# EAGLE board regsimple2addfp copy (EAGLE 7.6.0), part 1 of 2
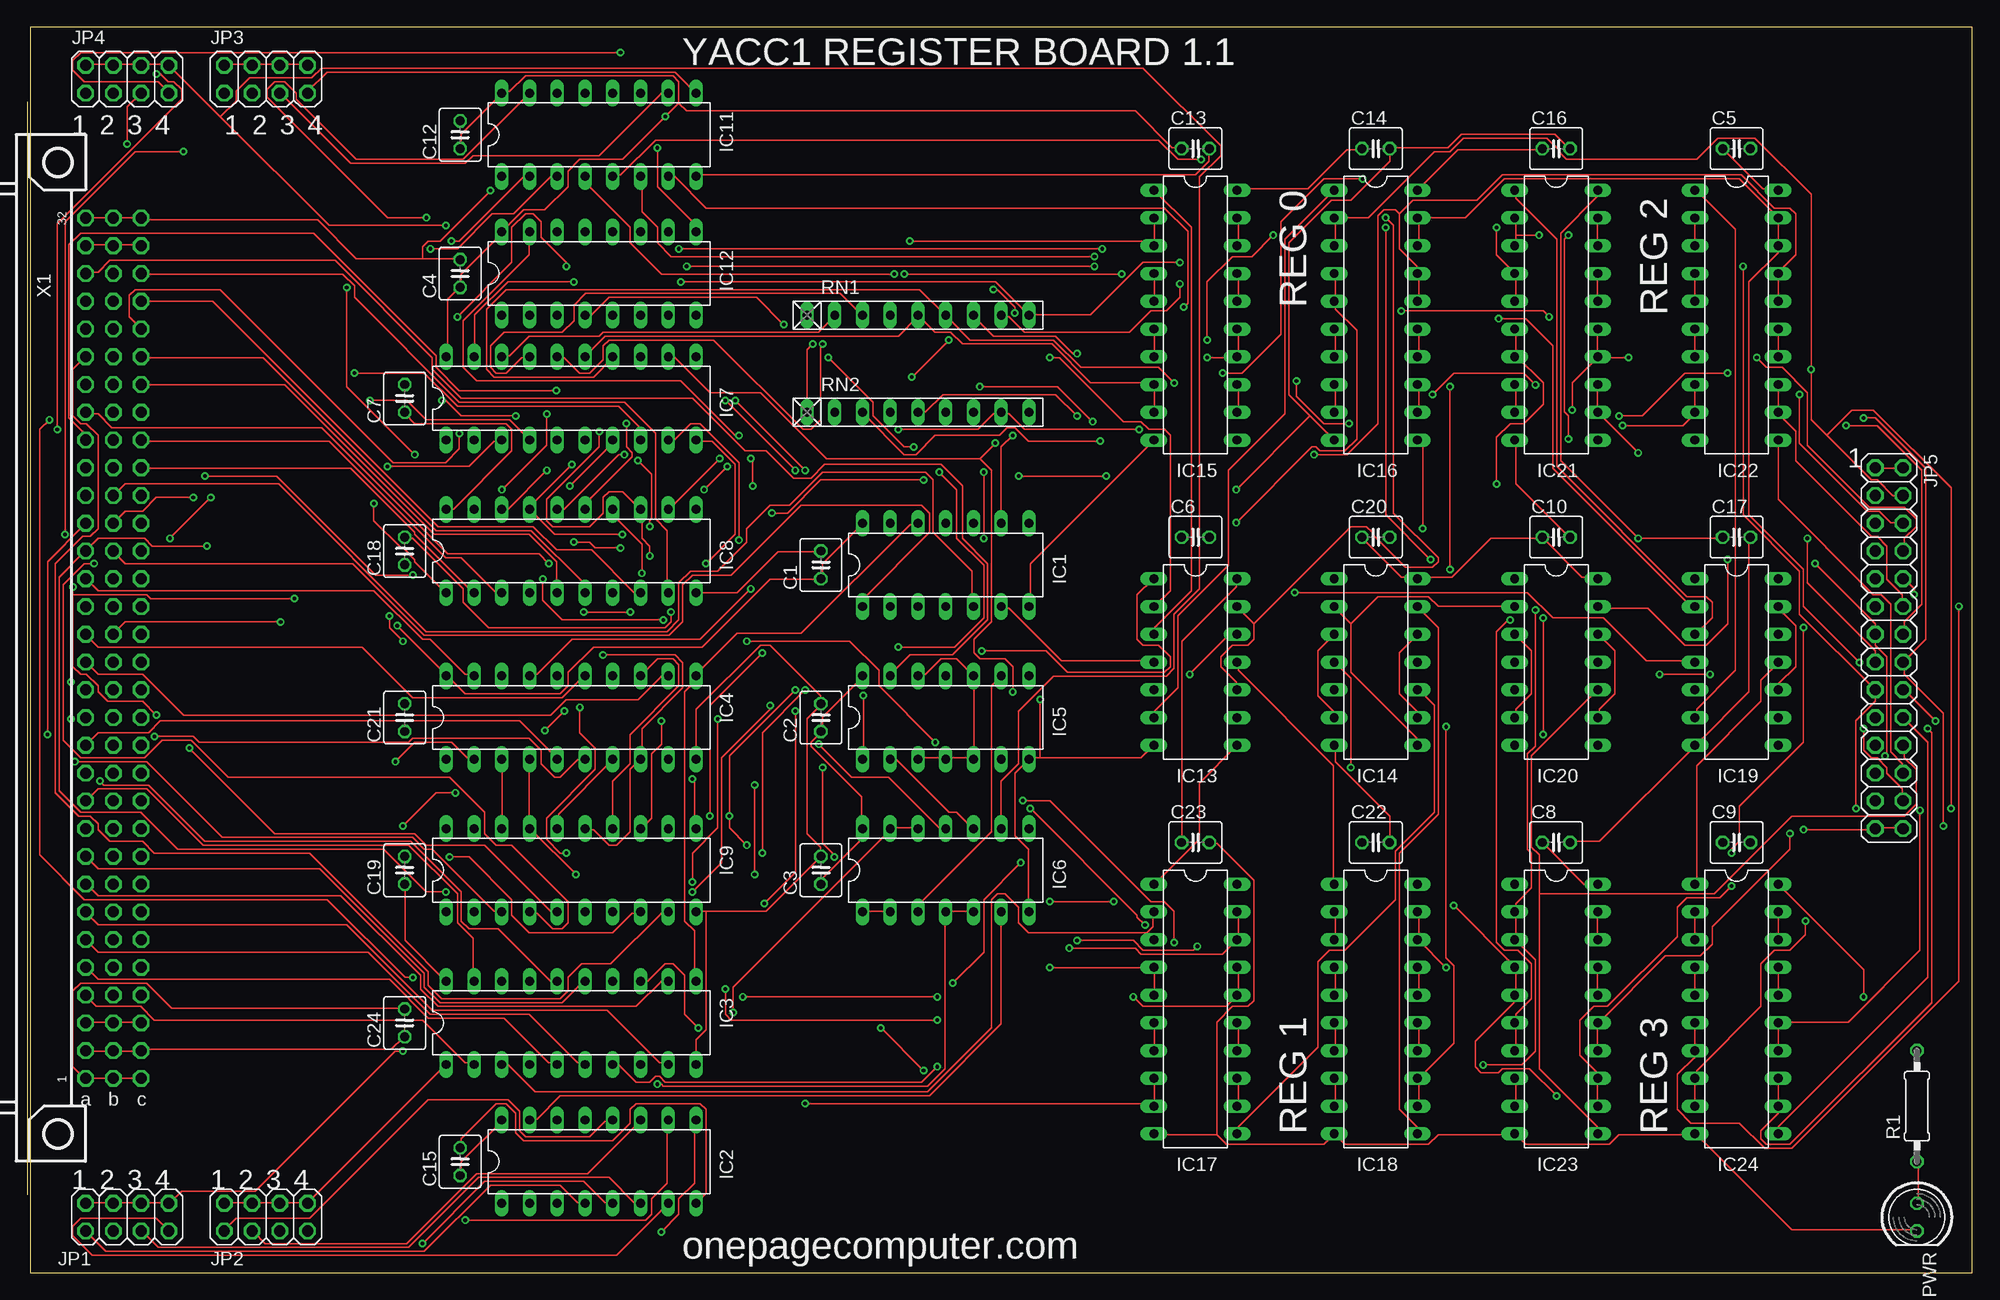
[diagram p2: board, top side]
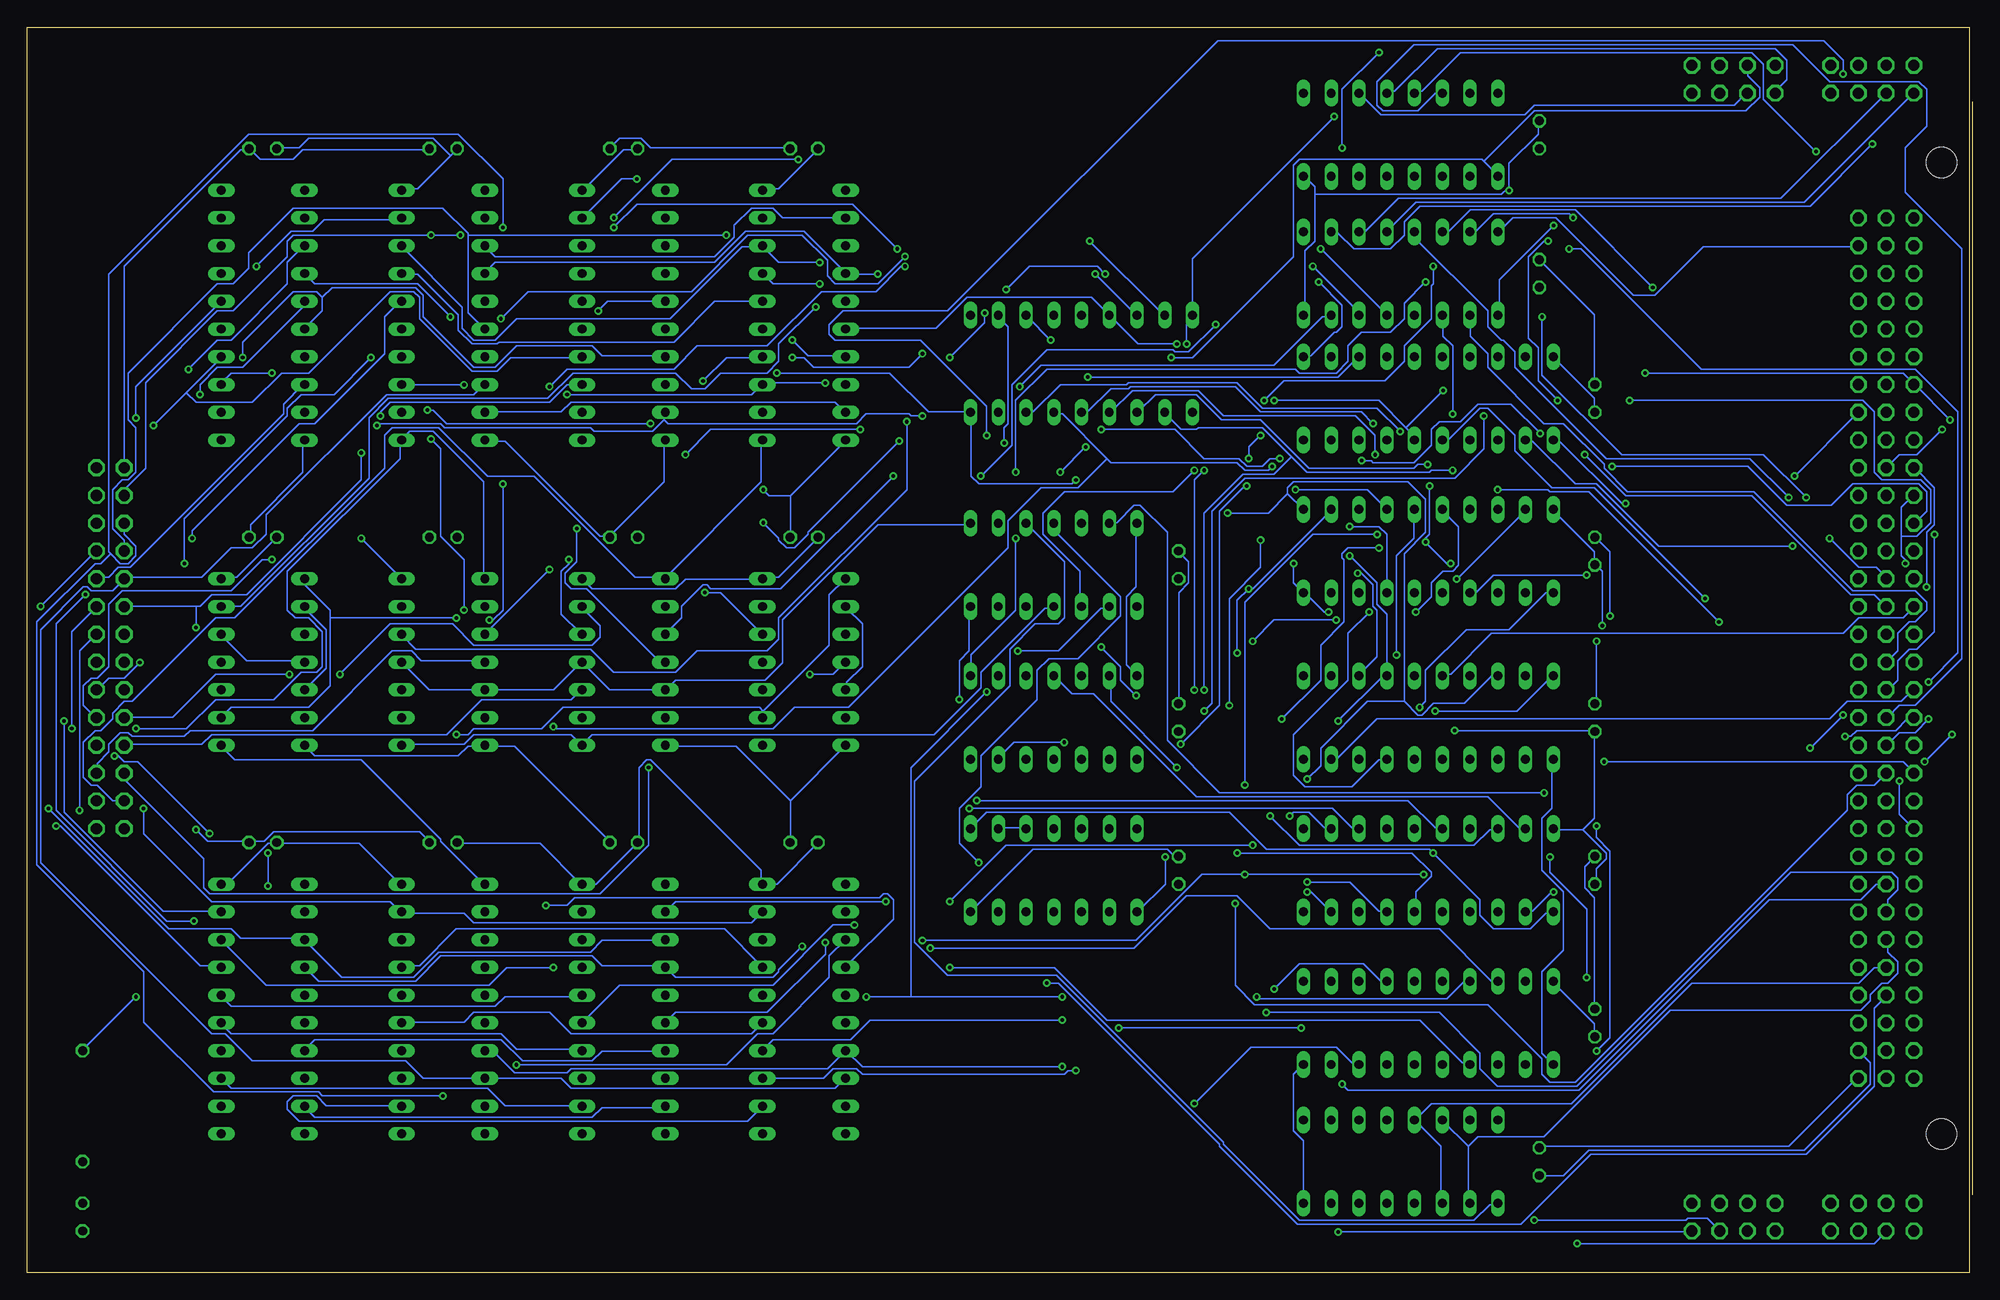
[diagram p3: board, bottom side, seen from below]

Size 177.78 x 113.97 mm. Coordinates in mm from the lower left corner, seen from the top.
Outline: 0,0 177.78,0 177.78,113.97 0,113.97 0,0
Copper layers (1*16): Top 0.0356mm / dielectric 1.5011mm / Bottom 0.0356mm
Design rules "LaenPCBOrder *": minimum track width 6mil, minimum drill 13mil, track to track 8mil, track to pad 8mil, pad to pad 8mil, via to via 8mil, smd to smd 6mil, copper to edge 20mil, drill to drill 6mil, minimum pad ring 7mil, minimum via ring 7mil, stop-mask expansion 3mil, vias tented up to drill 0mil, thermal gap 10mil
Net classes: 1 GND: width 1 mm; 2 5V: width 1 mm

## Footprints (pad centres in the part's own frame; a part is rotated, then mirrored left to right if it is on the bottom)
C025-040X050 = drill 0.813 octagon: 1 -1.27,0; 2 1.27,0
DIL14 = drill 0.813 long: 1 -7.62,-3.81; 2 -5.08,-3.81; 3 -2.54,-3.81; 4 0,-3.81; 5 2.54,-3.81; 6 5.08,-3.81; 7 7.62,-3.81; 8 7.62,3.81; 9 5.08,3.81; 10 2.54,3.81; 11 0,3.81; 12 -2.54,3.81; 13 -5.08,3.81; 14 -7.62,3.81
DIL16 = drill 0.813 long: 1 -8.89,-3.81; 2 -6.35,-3.81; 3 -3.81,-3.81; 4 -1.27,-3.81; 5 1.27,-3.81; 6 3.81,-3.81; 7 6.35,-3.81; 8 8.89,-3.81; 9 8.89,3.81; 10 6.35,3.81; 11 3.81,3.81; 12 1.27,3.81; 13 -1.27,3.81; 14 -3.81,3.81; 15 -6.35,3.81; 16 -8.89,3.81
DIL20 = drill 0.813 long: 1 -11.43,-3.81; 2 -8.89,-3.81; 3 -6.35,-3.81; 4 -3.81,-3.81; 5 -1.27,-3.81; 6 1.27,-3.81; 7 3.81,-3.81; 8 6.35,-3.81; 9 8.89,-3.81; 10 11.43,-3.81; 11 11.43,3.81; 12 8.89,3.81; 13 6.35,3.81; 14 3.81,3.81; 15 1.27,3.81; 16 -1.27,3.81; 17 -3.81,3.81; 18 -6.35,3.81; 19 -8.89,3.81; 20 -11.43,3.81
2X04 = drill 1.016 octagon: 1 -3.81,-1.27; 2 -3.81,1.27; 3 -1.27,-1.27; 4 -1.27,1.27; 5 1.27,-1.27; 6 1.27,1.27; 7 3.81,-1.27; 8 3.81,1.27
2X14 = drill 1.016 octagon: 1 -16.51,-1.27; 2 -16.51,1.27; 3 -13.97,-1.27; 4 -13.97,1.27; 5 -11.43,-1.27; 6 -11.43,1.27; 7 -8.89,-1.27; 8 -8.89,1.27; 9 -6.35,-1.27; 10 -6.35,1.27; 11 -3.81,-1.27; 12 -3.81,1.27; 13 -1.27,-1.27; 14 -1.27,1.27; 15 1.27,-1.27; 16 1.27,1.27; 17 3.81,-1.27; 18 3.81,1.27; 19 6.35,-1.27; 20 6.35,1.27; 21 8.89,-1.27; 22 8.89,1.27; 23 11.43,-1.27; 24 11.43,1.27; 25 13.97,-1.27; 26 13.97,1.27; 27 16.51,-1.27; 28 16.51,1.27
LED5MM = drill 0.813 octagon: A -1.27,0; K 1.27,0
0207/10 = drill 0.813 octagon: 1 -5.08,0; 2 5.08,0
RN-9 = drill 0.813 long: 1 -10.16,0; 2 -7.62,0; 3 -5.08,0; 4 -2.54,0; 5 0,0; 6 2.54,0; 7 5.08,0; 8 7.62,0; 9 10.16,0
FABC96R = drill 1.016 octagon: A1 -2.54,39.37; A2 -2.54,36.83; A3 -2.54,34.29; A4 -2.54,31.75; A5 -2.54,29.21; A6 -2.54,26.67; A7 -2.54,24.13; A8 -2.54,21.59; A9 -2.54,19.05; A10 -2.54,16.51; A11 -2.54,13.97; A12 -2.54,11.43; A13 -2.54,8.89; A14 -2.54,6.35; A15 -2.54,3.81; A16 -2.54,1.27; A17 -2.54,-1.27; A18 -2.54,-3.81; A19 -2.54,-6.35; A20 -2.54,-8.89; A21 -2.54,-11.43; A22 -2.54,-13.97; A23 -2.54,-16.51; A24 -2.54,-19.05; A25 -2.54,-21.59; A26 -2.54,-24.13; A27 -2.54,-26.67; A28 -2.54,-29.21; A29 -2.54,-31.75; A30 -2.54,-34.29; A31 -2.54,-36.83; A32 -2.54,-39.37; B1 -5.08,39.37; B2 -5.08,36.83; B3 -5.08,34.29; B4 -5.08,31.75; B5 -5.08,29.21; B6 -5.08,26.67; B7 -5.08,24.13; B8 -5.08,21.59; B9 -5.08,19.05; B10 -5.08,16.51; B11 -5.08,13.97; B12 -5.08,11.43; B13 -5.08,8.89; B14 -5.08,6.35; B15 -5.08,3.81; B16 -5.08,1.27; B17 -5.08,-1.27; B18 -5.08,-3.81; B19 -5.08,-6.35; B20 -5.08,-8.89; B21 -5.08,-11.43; B22 -5.08,-13.97; B23 -5.08,-16.51; B24 -5.08,-19.05; B25 -5.08,-21.59; B26 -5.08,-24.13; B27 -5.08,-26.67; B28 -5.08,-29.21; B29 -5.08,-31.75; B30 -5.08,-34.29; B31 -5.08,-36.83; B32 -5.08,-39.37; C1 -7.62,39.37; C2 -7.62,36.83; C3 -7.62,34.29; C4 -7.62,31.75; C5 -7.62,29.21; C6 -7.62,26.67; C7 -7.62,24.13; C8 -7.62,21.59; C9 -7.62,19.05; C10 -7.62,16.51; C11 -7.62,13.97; C12 -7.62,11.43; C13 -7.62,8.89; C14 -7.62,6.35; C15 -7.62,3.81; C16 -7.62,1.27; C17 -7.62,-1.27; C18 -7.62,-3.81; C19 -7.62,-6.35; C20 -7.62,-8.89; C21 -7.62,-11.43; C22 -7.62,-13.97; C23 -7.62,-16.51; C24 -7.62,-19.05; C25 -7.62,-21.59; C26 -7.62,-24.13; C27 -7.62,-26.67; C28 -7.62,-29.21; C29 -7.62,-31.75; C30 -7.62,-34.29; C31 -7.62,-36.83; C32 -7.62,-39.37 | hole 2.794: 0,-44.456; 0,44.456

## Placement (x,y rotation side)
C1  [C025-040X050]  72.39,64.77 90 top
C2  [C025-040X050]  72.39,50.8 90 top
C3  [C025-040X050]  72.39,36.83 90 top
C4  [C025-040X050]  39.37,91.44 90 top
C5  [C025-040X050]  156.21,102.87 0 top
C6  [C025-040X050]  106.68,67.31 0 top
C7  [C025-040X050]  34.29,80.01 90 top
C8  [C025-040X050]  139.7,39.37 0 top
C9  [C025-040X050]  156.21,39.37 0 top
C10  [C025-040X050]  139.7,67.31 0 top
C12  [C025-040X050]  39.37,104.14 90 top
C13  [C025-040X050]  106.68,102.87 0 top
C14  [C025-040X050]  123.19,102.87 0 top
C15  [C025-040X050]  39.37,10.16 90 top
C16  [C025-040X050]  139.7,102.87 0 top
C17  [C025-040X050]  156.21,67.31 0 top
C18  [C025-040X050]  34.29,66.04 90 top
C19  [C025-040X050]  34.29,36.83 90 top
C20  [C025-040X050]  123.19,67.31 0 top
C21  [C025-040X050]  34.29,50.8 90 top
C22  [C025-040X050]  123.19,39.37 0 top
C23  [C025-040X050]  106.68,39.37 0 top
C24  [C025-040X050]  34.29,22.86 90 top
IC1  74LS04N  [DIL14]  83.82,64.77 0 top
IC2  74LS139N  [DIL16]  52.07,10.16 0 top
IC3  74S374N  [DIL20]  49.53,22.86 0 top
IC4  74S374N  [DIL20]  49.53,50.8 0 top
IC5  74LS00N  [DIL14]  83.82,50.8 0 top
IC6  74LS00N  [DIL14]  83.82,36.83 0 top
IC7  74LS245N  [DIL20]  49.53,80.01 0 top
IC8  74LS245N  [DIL20]  49.53,66.04 0 top
IC9  74LS245N  [DIL20]  49.53,36.83 0 top
IC11  74LS139N  [DIL16]  52.07,104.14 0 top
IC12  74LS139N  [DIL16]  52.07,91.44 0 top
IC13  7432N  [DIL14]  106.68,55.88 270 top
IC14  74LS02N  [DIL14]  123.19,55.88 270 top
IC15  74S374N  [DIL20]  106.68,87.63 270 top
IC16  74S374N  [DIL20]  123.19,87.63 270 top
IC17  74S374N  [DIL20]  106.68,24.13 270 top
IC18  74S374N  [DIL20]  123.19,24.13 270 top
IC19  7432N  [DIL14]  156.21,55.88 270 top
IC20  74LS02N  [DIL14]  139.7,55.88 270 top
IC21  74S374N  [DIL20]  139.7,87.63 270 top
IC22  74S374N  [DIL20]  156.21,87.63 270 top
IC23  74S374N  [DIL20]  139.7,24.13 270 top
IC24  74S374N  [DIL20]  156.21,24.13 270 top
JP1  [2X04]  8.89,5.08 0 top
JP2  [2X04]  21.59,5.08 0 top
JP3  [2X04]  21.59,109.22 0 top
JP4  [2X04]  8.89,109.22 0 top
JP5  [2X14]  170.18,57.15 270 top
PWR  [LED5MM]  172.72,5.08 270 top
R1  330  [0207/10]  172.72,15.24 90 top
RN1  [RN-9]  81.28,87.63 0 top
RN2  [RN-9]  81.28,78.74 0 top
X1  FABC96R  [FABC96R]  2.54,57.15 180 top

## Tracks (layer width: path | path; a pad name or v marks a point on that pad's centre or on a via)
+12V
  Top 0.152: X1.A3 5.16,22.94 7.47,22.94 X1.B3 7.64,22.94 10.13,22.94 X1.C3
-R0-RDSEL  (via drill 0.33)
  Top 0.152: v79.12,91.39 57.78,91.39 54.94,94.23 54.94,95.66 50.85,99.75 50.85,100.28 IC11.4 | v88.19,89.97 88.54,89.97 90.14,88.37 v90.14,87.83 | v93.34,83.74 94.23,83.74 100.1,77.88 101.7,77.88 102.41,77.17 103.83,77.17 104.37,76.63 104.37,62.41 102.95,60.98 IC13.2
  Bottom 0.152: v79.12,91.39 79.83,92.1 86.06,92.1 v88.19,89.97 | v90.14,87.83 90.14,86.94 v93.34,83.74 | IC13.5 102.77,53.34 102.77,54.05 101.35,55.47 101.35,59.38 102.77,60.81 IC13.2
-R0-WRSEL  (via drill 0.33)
  Top 0.152: IC14.6 119.3,50.85 119.3,51.38 117.88,52.81 117.88,56.9 119.3,58.32 IC14.3 | v68.99,86.77 66.5,89.26 52.98,89.26 51.38,87.66 50.85,87.66 IC12.4 | v98.5,72.9 v90.5,72.9
  Bottom 0.152: v68.99,86.77 71.48,84.28 72.72,84.28 72.9,84.45 84.45,84.45 87.66,81.25 87.66,75.74 v90.5,72.9 | v98.5,72.9 108.81,62.59 115.21,62.59 115.57,62.94 115.93,62.94 117.88,60.98 117.88,59.92 IC14.3
-R1-RDSEL  (via drill 0.33)
  Top 0.152: 112.01,59.38 112.01,57.96 111.48,57.43 110.06,57.43 108.99,56.36 108.99,55.47 110.41,54.05 110.41,53.34 IC13.10 | 112.01,59.38 110.59,60.81 IC13.13 | v107.21,101.88 105.08,101.88 103.3,103.66 57.25,103.66 54.05,100.46 53.34,100.46 IC11.5 | v124.1,96.55 124.82,95.83 124.82,69.52 128.91,65.43 128.91,65.08 128.37,64.54 125.88,64.54 122.86,67.56 122.86,67.74 122.33,68.28 120.9,68.28 112.01,59.38
  Bottom 0.152: v107.21,101.88 118.77,101.88 v124.1,96.55
-R1-WRSEL  (via drill 0.33)
  Top 0.152: v98.15,93.7 v59.38,93.7 | v124.1,95.66 124.1,69.34 v128.19,65.25 | IC14.9 126.95,50.85 126.95,51.38 125.35,52.98 125.35,56.72 126.95,58.32 IC14.12
  Bottom 0.152: v59.38,93.7 53.34,87.66 IC12.5 | v98.15,93.7 102.23,97.79 121.97,97.79 v124.1,95.66 | v128.19,65.25 128.19,64.9 128.91,64.19 128.91,60.27 127.13,58.5 IC14.12
-R2-RDSEL  (via drill 0.33)
  Top 0.152: v97.43,92.99 58.67,92.99 57.43,94.23 57.43,95.66 56.01,97.08 56.01,100.28 IC11.6 | v134.42,87.3 136.91,87.3 139.4,84.81 139.4,73.61 152.02,60.98 152.38,60.98 IC19.2
  Bottom 0.152: v97.43,92.99 99.92,90.5 103.83,90.5 104.55,91.21 104.55,92.63 106.86,94.94 111.84,94.94 116.99,89.79 131.93,89.79 v134.42,87.3 | IC19.5 152.38,53.34 150.42,55.3 150.42,58.85 152.38,60.81 IC19.2
-R2-WRSEL  (via drill 0.33)
  Top 0.152: v97.43,92.1 v60.1,92.1 | v129.97,64.36 v129.97,81.08 | IC20.6 136.02,50.85 136.02,51.56 137.44,52.98 137.44,56.9 136.02,58.32 IC20.3
  Bottom 0.152: v60.1,92.1 56.01,88.01 56.01,87.66 IC12.6 | v97.43,92.1 97.79,92.1 100.1,89.79 105.08,89.79 110.06,84.81 116.46,84.81 118.59,82.68 128.37,82.68 v129.97,81.08 | v129.97,64.36 135.84,58.5 IC20.3
-R3-RDSEL  (via drill 0.33)
  Top 0.152: IC19.10 160.02,53.87 161.62,55.47 161.62,59.21 160.02,60.81 IC19.13 | v105.61,88.37 105.97,88.72 105.97,95.3 103.83,97.43 61.87,97.43 59.03,100.28 58.5,100.28 IC11.7
  Bottom 0.152: v105.61,88.37 108.99,84.99 108.99,83.39 110.06,82.32 114.33,82.32 115.75,80.9 116.99,80.9 118.42,82.32 127.84,82.32 130.15,80.01 144.73,80.01 146.51,78.23 146.51,72.72 158.24,60.98 160.02,60.98 IC19.13
-R3-WRSEL  (via drill 0.33)
  Top 0.152: v86.94,81.08 94.06,81.08 v97.26,77.88 | IC20.9 143.66,50.85 143.66,51.56 145.09,52.98 145.09,56.9 143.66,58.32 IC20.12
  Bottom 0.152: v86.94,81.08 84.99,83.03 63.65,83.03 59.21,87.48 58.5,87.48 IC12.7 | v97.26,77.88 97.26,71.65 108.99,59.92 108.99,57.96 110.06,56.9 116.46,56.9 118.42,54.94 124.1,54.94 126.24,57.07 142.24,57.07 143.49,58.32 IC20.12
-RDSEL  (via drill 0.33)
  Top 0.152: JP3.2 17.78,110.59 20.27,110.59 JP3.4 20.45,110.59 22.76,110.59 JP3.6 22.94,110.59 25.25,110.59 JP3.8 | v76.28,52.81 76.28,47.12 IC5.1 | v79.48,57.25 84.63,57.25 87.3,59.92 87.3,64.72 84.81,67.21 84.81,71.65 v83.21,73.25 | v80.9,75.56 80.01,75.56 77.17,78.41 77.17,79.65 v73.08,83.74
  Bottom 0.152: v76.28,52.81 77.7,54.23 77.7,55.47 v79.48,57.25 | v80.9,75.56 v83.21,73.25 | v73.08,83.74 71.12,83.74 61.87,92.99 61.87,101.35 61.34,101.88 44.63,101.88 44.45,101.7 | 44.45,101.7 43.2,100.46 IC11.1 | 44.45,101.7 39.83,106.32 20.45,106.32 19.2,107.57 19.2,108.46 20.27,109.53 20.27,110.41 JP3.4
-RFUNC  (via drill 0.33)
  Top 0.152: v36.27,96.55 32.72,96.55 21.69,107.57 21.69,108.28 22.4,108.99 23.29,108.99 24.36,107.92 24.36,107.39 29.87,101.88 39.65,101.88 IC11.15 | v72.19,48.36 75.21,45.34 78.59,45.34 83.21,40.72 83.74,40.72 IC6.11 | v66.14,72.01 66.14,74.32 v65.96,74.5 | v64.9,76.63 64.54,76.63 59.56,81.61 40.89,81.61 39.65,82.86 39.65,87.12 45.7,93.17 45.7,95.12 IC12.15
  Bottom 0.152: v36.27,96.55 36.63,96.9 43.56,96.9 45.16,95.3 45.7,95.3 IC12.15 | v72.19,48.36 68.63,51.92 68.63,69.7 66.32,72.01 v66.14,72.01 | v65.96,74.5 65.96,75.56 v64.9,76.63
-RRDH  (via drill 0.33)
  Top 0.152: IC1.6 88.9,60.81 89.61,60.81 94.41,56.01 102.77,56.01 IC13.4 | v106.15,54.76 109.7,58.32 110.41,58.32 IC13.12 | v115.75,62.23 137.08,62.23 139.4,59.92 144.02,59.92 147.93,56.01 152.38,56.01 IC19.4
  Bottom 0.152: IC19.4 152.55,56.01 157.71,56.01 160.02,58.32 IC19.12 | v106.15,54.76 104.01,54.76 102.95,55.83 IC13.4 | v115.75,62.23 114.33,62.23 110.59,58.5 IC13.12
-RRDL  (via drill 0.33)
  Top 0.152: v87.12,56.9 92.99,56.9 94.94,54.94 103.83,54.94 104.37,55.47 104.37,56.36 103.3,57.43 101.88,57.43 101.35,57.96 101.35,62.05 102.77,63.48 IC13.1 | v138.51,49.25 v138.51,59.92
  Bottom 0.152: 150.06,59.92 150.06,53.7 152.02,51.74 159.13,51.74 160.02,50.85 IC19.9 | 150.06,59.92 150.06,60.63 152.38,62.94 152.38,63.48 IC19.1 | 110.41,51.38 110.41,50.85 IC13.9 110.41,51.38 | 110.41,51.38 104.37,57.43 104.37,62.05 102.95,63.48 IC13.1 | v87.12,56.9 83.39,56.9 79.48,60.81 78.77,60.81 IC1.2 | v138.51,59.92 150.06,59.92 | v138.51,49.25 137.44,49.25 136.91,49.78 130.68,49.78 128.73,51.74 110.77,51.74 110.41,51.38
-RWRH
  Bottom 0.152: IC20.11 143.49,55.83 141,53.34 IC20.5 129.62,53.34 127.13,55.83 IC14.11 124.46,53.34 IC14.5 119.3,53.34 118.42,54.23 110.24,54.23 108.64,55.83 108.64,59.74 99.92,68.45 91.57,68.45 IC1.8
-RWRL
  Top 0.152: 120.9,59.38 120.9,54.94 126.95,48.9 126.95,48.36 IC14.8 | 120.9,59.38 119.48,60.81 IC14.2 | 120.9,59.38 123.39,61.87 128.02,61.87 128.91,60.98 135.84,60.98 IC20.2
  Bottom 0.152: IC1.4 83.92,60.81 84.63,60.81 90.5,54.94 90.5,53.52 94.77,49.25 126.06,49.25 126.95,48.36 IC14.8 127.13,48.36 128.02,49.25 136.91,49.25 137.79,48.36 143.49,48.36 IC20.8
-WRSEL  (via drill 0.33)
  Top 0.152: IC5.2 78.77,46.94 79.3,46.94 84.1,42.14 84.81,42.14 86.23,40.72 IC6.10 | JP4.2 5.16,110.59 7.47,110.59 JP4.4 7.64,110.59 10.13,110.59 JP4.6 10.31,110.59 12.62,110.59 JP4.8 12.8,110.41 17.42,105.79 | v38.05,95.83 27.38,95.83 17.42,105.79 | IC6.9 88.9,44.98 90.5,46.58 90.5,51.38 93.7,54.59 104.01,54.59 104.72,55.3 104.72,60.27 107.04,62.59 107.04,100.28 108.99,102.23 108.99,103.12 101.88,110.24 26.67,110.24 25.78,109.35 20.09,109.35 18.85,108.1 18.85,107.21 17.42,105.79
  Bottom 0.152: IC6.10 86.41,40.72 88.9,40.72 IC6.9 | v38.05,95.83 43.03,90.86 43.03,87.66 IC12.1
ADATA0  (via drill 0.33)
  Top 0.152: 102.23,31.11 91.39,31.11 90.5,32 90.5,33.43 89.26,34.67 88.54,34.67 88.01,34.14 88.01,22.4 82.14,16.54 46.23,16.54 43.74,19.02 43.2,19.02 IC3.3 | IC17.3 102.23,31.11 | 102.23,31.11 102.77,31.65 102.77,32.89 IC17.2 | v132.99,19.02 136.55,19.02 137.79,20.27 137.79,28.63 136.02,30.4 IC23.3 136.02,30.58 136.02,32.89 IC23.2 136.02,33.07 136.02,33.78 137.44,35.2 137.44,38.41 137.08,38.76 137.08,47.47 137.79,48.18 v137.79,60.63 | IC7.18 43.2,83.92 43.92,83.92 45.7,85.7 52.09,85.7 52.45,86.06 72.19,86.06 73.61,87.48 RN1.2 | 102.95,94.41 102.95,96.37 IC15.2 | 102.95,94.41 102.95,94.06 IC15.3 102.95,94.41 | 136.02,94.94 136.02,96.37 IC21.2 | 136.02,94.94 136.02,94.06 IC21.3 | 136.02,94.94 v138.15,94.94 | 102.95,94.41 v80.54,94.41 | v140.82,76.28 140.82,78.41 140.46,78.77 140.46,94.59 v140.82,94.94
  Bottom 0.152: v132.99,19.02 113.79,19.02 110.95,21.87 109.53,21.87 104.37,27.03 104.37,28.98 IC17.3 | JP5.3 168.91,71.65 166.95,73.61 166.95,81.43 160.38,88.01 158.95,88.01 153.97,92.99 153.97,94.41 153.44,94.94 v140.82,94.94 v138.15,94.94 | IC15.2 102.95,96.55 108.64,96.55 109.53,97.43 111.48,97.43 113.08,95.83 113.08,94.77 114.86,92.99 134.95,92.99 135.84,93.88 IC21.3 | v80.54,94.41 73.79,87.66 RN1.2 | v137.79,60.63 137.79,65.25 139.93,67.39 139.93,75.39 v140.82,76.28
ADATA1  (via drill 0.33)
  Top 0.152: v93.34,27.91 102.77,27.91 IC17.4 102.95,27.91 102.95,25.43 IC17.5 | v130.33,33.6 135.84,28.09 IC23.4 136.02,27.91 136.02,25.43 IC23.5 135.84,25.25 135.84,24.71 132.28,21.16 132.28,18.85 132.82,18.31 134.42,18.31 134.77,18.67 137.26,18.67 v139.75,16.18 | IC7.17 45.7,83.74 44.98,83.74 43.56,82.32 42.67,82.32 42.14,82.86 42.14,84.81 43.38,86.06 48.72,86.06 49.78,87.12 49.78,88.54 50.85,89.61 74.14,89.61 76.1,87.66 RN1.3 | IC15.5 102.95,88.9 102.95,91.39 IC15.4 | IC21.5 136.02,88.9 136.02,91.39 IC21.4 135.84,91.57 134.24,93.17 v134.24,95.66 | v99.92,91.39 v80.01,91.39
  Bottom 0.152: v93.34,27.91 83.74,27.91 78.94,23.11 50.32,23.11 46.41,19.2 45.87,19.2 IC3.4 | v130.33,33.6 128.37,33.6 127.66,34.31 99.75,34.31 99.39,34.67 99.03,34.67 98.5,34.14 98.5,32.36 102.77,28.09 IC17.4 | JP5.5 168.91,67.56 167.84,66.5 167.84,65.61 168.55,64.9 169.27,64.9 170.16,65.79 | 170.16,65.79 170.33,65.96 170.33,91.39 157.53,104.19 138.33,104.19 134.24,100.1 v134.24,95.66 | IC21.4 135.84,91.57 134.95,92.46 114.86,92.46 112.01,95.3 106.68,95.3 102.95,91.57 IC15.4 102.77,91.39 v99.92,91.39 | v80.01,91.39 76.28,87.66 RN1.3 | v139.75,16.18 150.77,16.18 151.13,16.54 160.73,16.54 167.13,22.94 167.13,27.56 176.91,37.34 176.91,59.56 171.58,64.9 171.04,64.9 170.16,65.79
ADATA2  (via drill 0.33)
  Top 0.152: IC23.7 136.02,20.45 136.02,22.76 IC23.6 136.02,22.94 136.02,23.65 137.44,25.07 137.44,28.27 136.19,29.52 134.95,29.52 134.24,30.23 134.24,58.67 135.31,59.74 v135.48,59.74 | v83.03,18.85 81.61,17.42 58.14,17.42 57.61,17.96 57.25,17.96 56.72,17.42 55.47,17.42 53.87,19.02 53.34,19.02 IC3.7 | IC17.6 102.95,22.76 102.95,20.45 IC17.7 | IC15.7 102.95,83.92 102.95,86.23 IC15.6 | v72.54,84.99 72.36,84.81 72.36,78.05 71.48,77.17 70.76,77.17 62.59,85.34 52.98,85.34 52.45,84.81 52.45,83.57 51.21,82.32 50.32,82.32 48.9,83.74 48.36,83.74 IC7.16 | 136.02,83.92 136.02,86.23 IC21.6 | v107.75,85.34 107.75,90.68 110.06,92.99 111.84,92.99 v113.79,94.94 | v134.24,72.19 134.24,76.45 135.48,77.7 136.73,77.7 138.51,79.48 138.51,81.43 136.02,83.92 | 136.02,83.92 IC21.7
  Bottom 0.152: v83.03,18.85 101.35,18.85 102.77,20.27 IC17.7 102.95,20.27 104.55,18.67 128.02,18.67 128.37,18.31 133.17,18.31 135.13,20.27 135.84,20.27 IC23.7 | v72.54,84.99 76.1,84.99 RN1.4 80.37,89.26 91.75,89.26 94.59,86.41 102.77,86.41 IC15.6 | JP5.7 168.91,67.03 169.98,68.1 169.98,71.65 169.09,72.54 168.55,72.54 167.84,73.25 167.84,77.34 168.55,78.05 168.55,82.32 160.38,90.5 158.95,90.5 157.53,91.92 157.53,93.34 153.44,97.43 139.75,97.43 137.44,95.12 137.44,94.94 | 137.44,94.94 137.44,87.83 136.02,86.41 IC21.6 | v107.75,85.34 106.32,83.92 102.95,83.92 IC15.7 | 137.44,94.94 v113.79,94.94 | v135.48,59.74 135.13,59.74 134.24,60.63 v134.24,72.19
ADATA3  (via drill 0.33)
  Top 0.152: IC23.9 136.02,15.29 136.02,17.78 IC23.8 | 102.95,15.47 102.95,17.78 IC17.8 | 102.95,15.47 102.95,15.29 IC17.9 102.95,15.47 | 102.95,15.47 v70.94,15.47 | IC21.9 136.02,78.77 136.02,81.25 IC21.8 | IC15.9 102.95,78.77 102.95,81.25 IC15.8 102.77,81.43 97.08,81.43 93.52,84.99 85.34,84.99 84.28,86.06 82.86,86.06 RN1.5 81.25,87.48 79.48,85.7 52.63,85.7 50.85,83.92 IC7.15
  Bottom 0.152: v70.94,15.47 65.79,20.62 57.96,20.62 56.54,19.2 56.01,19.2 IC3.8 | IC17.8 102.95,17.78 103.83,16.89 128.02,16.89 128.91,17.78 IC23.8 141.53,17.78 143.13,19.38 157.18,19.38 159.66,21.87 160.91,21.87 176.56,37.52 176.56,58.85 172.64,62.76 172.29,62.76 171.93,62.41 169.98,62.41 168.91,63.48 JP5.9 168.91,63.65 161.8,63.65 159.13,66.32 157.18,66.32 155.93,67.56 155.93,69.34 144.91,80.37 136.91,80.37 136.02,81.25 IC21.8 | IC21.9 135.84,78.77 128.91,78.77 128.02,79.65 103.83,79.65 102.95,78.77 IC15.9
ADATA4  (via drill 0.33)
  Top 0.152: 143.49,17.78 143.49,15.29 IC23.12 | IC17.12 110.59,15.29 110.59,17.78 IC17.13 | IC3.13 56.54,26.67 58.14,28.27 58.85,28.27 59.92,27.2 59.92,23.65 v61.16,22.4 | v81.79,18.49 v77.88,22.4 | IC21.13 143.49,81.25 143.49,78.77 IC21.12 v147.22,75.03 | IC15.12 110.59,78.77 110.59,81.25 IC15.13 | IC7.14 53.34,83.74 51.56,81.97 42.49,81.97 41.78,82.68 41.78,88.19 43.56,89.97 81.43,89.97 83.74,87.66 RN1.6 83.92,87.48 86.06,85.34 93.7,85.34 96.19,82.86 103.3,82.86 v104.72,81.43 | v137.79,81.25 136.73,82.32 130.33,82.32 v128.37,80.37 | 143.49,17.78 143.49,18.31 141.88,19.91 141.88,23.11 143.13,24.36 144.37,24.36 150.77,30.76 150.77,33.43 151.66,34.31 154.69,34.31 v155.75,35.38 | v155.75,38.41 155.75,38.76 156.46,39.47 156.46,42.67 162.33,48.54 v162.33,59.03 | 143.49,17.78 IC23.13
  Bottom 0.152: v77.88,22.4 v61.16,22.4 | v81.79,18.49 82.5,18.49 82.86,18.14 101.35,18.14 101.88,18.67 104.01,18.67 104.9,17.78 IC17.13 | IC23.12 143.66,15.29 150.42,15.29 151.31,16.18 153.44,16.18 153.97,15.65 153.97,14.94 152.91,13.87 111.84,13.87 110.59,15.11 IC17.12 | 162.33,60.98 161.98,60.98 160.91,62.05 157.71,62.05 147.22,72.54 v147.22,75.03 | 162.33,60.98 168.91,60.98 JP5.11 | v104.72,81.43 110.41,81.43 IC15.13 110.59,81.25 111.48,80.37 v128.37,80.37 | v137.79,81.25 143.49,81.25 IC21.13 | v155.75,38.41 v155.75,35.38 | 162.33,60.98 v162.33,59.03
ADATA5  (via drill 0.33)
  Top 0.152: IC15.15 110.59,86.23 110.59,83.92 IC15.14 110.41,83.74 v107.75,83.74 | v84.1,85.34 v80.72,81.97 | v95.83,84.1 95.48,84.1 93.88,85.7 88.19,85.7 86.41,87.48 RN1.7 | IC21.14 143.49,83.92 143.49,86.23 IC21.15 | v163.4,64.9 168.91,59.38 JP5.13 168.91,57.43 169.98,56.36 169.98,47.47 v169.8,47.3 | v146.33,83.74 143.66,83.74 IC21.14 | IC23.14 143.49,20.45 143.49,22.76 IC23.15 143.66,22.94 149.71,28.98 152.91,28.98 153.97,30.05 153.97,31.65 161.09,38.76 v161.09,40.18 | v63.65,25.96 63.65,23.65 64.19,23.11 v83.03,23.11 | IC17.15 110.59,22.76 110.59,20.45 IC17.14 | v115.93,81.61 115.93,80.19 118.42,77.7 v120.73,77.7 | v141.17,78.94 141.17,81.43 143.49,83.74 IC21.14
  Bottom 0.152: v80.72,81.97 57.78,81.97 56.01,83.74 IC7.13 | v84.1,85.34 86.23,87.48 RN1.7 | v107.75,83.74 106.68,83.74 105.79,82.86 97.08,82.86 v95.83,84.1 | v163.4,64.9 163.4,68.99 153.97,78.41 153.97,79.12 152.73,80.37 149.71,80.37 v146.33,83.74 | IC3.14 53.87,26.67 55.47,28.27 61.34,28.27 v63.65,25.96 | v83.03,23.11 100.64,23.11 102.41,21.34 109.53,21.34 110.41,20.45 IC17.14 | IC17.15 111.48,21.87 128.02,21.87 129.97,23.82 136.91,23.82 137.79,22.94 143.49,22.94 IC23.15 | v169.8,47.3 169.44,47.3 168.91,46.76 167.66,46.76 v161.09,40.18 | v115.93,81.61 113.79,83.74 110.59,83.74 IC15.14 | v120.73,77.7 139.4,77.7 140.64,78.94 v141.17,78.94
ADATA6  (via drill 0.33)
  Top 0.152: IC23.16 143.49,25.43 143.49,27.91 IC23.17 | v83.03,25.25 v65.25,25.25 | v100.99,25.25 101.88,24.36 109.53,24.36 110.41,25.25 IC17.16 110.59,25.43 110.59,27.91 IC17.17 | 86.94,74.5 72.9,74.5 66.85,80.54 62.23,80.54 59.03,83.74 58.5,83.74 IC7.12 | v88.37,75.92 86.94,74.5 | IC15.16 110.59,88.9 110.59,91.39 IC15.17 | IC21.16 143.49,88.9 143.49,91.39 IC21.17 | JP5.15 168.91,56.9 162.69,63.12 v162.69,67.21 | v105.26,90.5 105.26,89.26 104.01,88.01 102.59,88.01 100.64,86.06 91.03,86.06 89.61,87.48 88.9,87.48 RN1.8 | v89.97,53.16 89.97,55.47 89.26,56.19 86.94,56.19 86.41,56.72 86.41,57.96 88.01,59.56 88.01,73.43 86.94,74.5
  Bottom 0.152: IC3.17 46.23,26.67 47.83,25.07 65.08,25.07 v65.25,25.25 | v100.99,25.25 96.9,25.25 | 96.9,25.25 v83.03,25.25 | IC23.17 143.49,28.09 141.88,28.09 138.51,31.47 113.97,31.47 110.59,28.09 IC17.17 | v88.37,75.92 88.37,77.34 88.01,77.7 88.01,86.59 88.9,87.48 RN1.8 | v162.69,67.21 162.69,67.92 152.91,77.7 151.49,77.7 145.09,84.1 145.09,87.48 143.66,88.9 IC21.16 | IC15.16 114.86,88.9 118.59,85.17 134.59,85.17 134.77,84.99 137.08,84.99 138.33,86.23 138.33,87.66 142.06,91.39 143.49,91.39 IC21.17 | v105.26,90.5 109.53,90.5 110.41,91.39 IC15.17 | 96.9,25.25 96.9,46.23 v89.97,53.16
ADATA7  (via drill 0.33)
  Top 0.152: v59.56,90.68 88.37,90.68 91.39,87.66 RN1.9 91.57,87.66 97.08,87.66 101.88,92.46 v105.26,92.46 | IC15.18 110.59,94.06 110.59,96.37 IC15.19 | IC21.18 143.49,94.06 143.49,96.37 IC21.19 | IC23.18 143.49,30.58 143.49,32.89 IC23.19 | v167.13,42.49 167.13,50.49 168.91,52.27 JP5.17 161.98,60.27 161.98,64.19 156.82,69.34 v156.82,92.1 | v95.12,29.69 101.17,29.69 101.7,29.16 109.17,29.16 IC17.18 110.59,30.58 110.59,32.89 IC17.19
  Bottom 0.152: v59.56,90.68 57.43,88.54 57.43,86.59 57.96,86.06 58.14,86.06 60.27,83.92 60.81,83.92 IC7.11 | IC21.18 143.49,93.88 137.97,88.37 137.97,86.41 136.91,85.34 134.95,85.34 132.99,87.3 118.95,87.3 112.37,93.88 110.59,93.88 IC15.18 110.41,93.88 108.99,92.46 v105.26,92.46 | v167.13,42.49 167.13,40.18 160.91,33.96 144.55,33.96 143.66,33.07 IC23.19 143.49,32.89 137.79,32.89 136.91,32 111.48,32 110.59,32.89 IC17.19 | IC3.18 43.74,26.67 48.54,31.47 64.01,31.47 67.03,34.49 71.65,34.49 76.45,29.69 v95.12,29.69 | v156.82,92.1 153.62,95.3 151.66,95.3 150.6,96.37 143.66,96.37 IC21.19
ADATA8  (via drill 0.33)
  Top 0.152: IC9.18 43.2,40.72 43.2,46.94 IC4.3 | v47.3,73.43 43.74,69.88 43.2,69.88 IC8.18 | v70.05,53.34 64.01,47.3 v64.01,41.78 64.01,40.72 v65.61,39.12 | IC18.3 119.48,30.58 119.48,32.89 IC18.2 | IC24.3 152.38,30.58 152.38,32.89 IC24.2 | IC16.3 119.48,94.06 119.48,96.37 IC16.2 119.48,96.55 122.5,96.55 128.55,102.59 129.97,102.59 131.22,103.83 138.86,103.83 139.93,102.77 139.93,102.59 140.64,101.88 152.55,101.88 154.51,103.83 157.89,103.83 163.04,98.68 v163.04,82.68 163.04,78.05 164.47,76.63 | IC22.3 152.38,94.06 152.38,96.37 IC22.2 | JP5.4 170.51,71.12 169.09,72.54 168.55,72.54 164.47,76.63 | v175.84,42.49 175.84,71.83 168.73,78.94 166.78,78.94 164.47,76.63 | v99.21,33.96 v93.34,33.96
  Bottom 0.152: v47.3,73.43 49.25,73.43 49.43,73.25 60.63,73.25 62.05,74.68 | 62.05,74.68 64.72,77.34 70.59,77.34 70.76,77.17 72.19,77.17 73.61,78.59 RN2.2 | v64.01,41.78 61.34,39.12 45.34,39.12 43.92,40.54 43.2,40.54 IC9.18 | v70.05,53.34 70.05,69.52 66.5,73.08 63.65,73.08 62.05,74.68 | IC18.3 119.48,30.4 125.17,30.4 126.24,29.34 140.11,29.34 142.42,27.03 149,27.03 152.38,30.4 IC24.3 152.55,30.58 158.24,30.58 159.13,31.47 164.82,31.47 v175.84,42.49 | v163.04,82.68 160.38,85.34 159.13,85.34 153.97,90.5 153.97,92.46 152.55,93.88 IC22.3 | v65.61,39.12 88.19,39.12 v93.34,33.96 | v99.21,33.96 118.42,33.96 119.3,33.07 IC18.2
ADATA9  (via drill 0.33)
  Top 0.152: 119.48,88.9 119.48,91.39 IC16.4 | IC22.5 152.38,88.9 152.38,91.39 IC22.4 | v161.98,80.37 161.98,75.92 168.2,69.7 169.27,69.7 170.33,68.63 171.4,68.63 JP5.6 | v125.53,88.01 138.51,88.01 v139.04,87.48 | v49.61,73.97 45.87,70.23 45.87,69.88 IC8.17 48.01,67.56 v54.23,67.56 | IC4.4 45.7,46.94 45.7,40.72 IC9.17 45.87,40.54 v49.96,36.45 | IC18.5 119.48,25.43 119.48,27.91 IC18.4 | IC24.5 152.38,25.43 152.38,27.91 IC24.4 | v95.83,30.4 100.99,30.4 101.88,29.52 106.5,29.52 v106.86,29.87 | v66.32,36.45 v66.32,44.63 | 119.48,88.9 119.48,88.19 121.44,86.23 121.44,76.28 120.37,75.21 118.06,75.21 117.7,75.56 117.35,75.56 v110.41,68.63 | v97.97,76.1 91.39,76.1 90.14,77.34 89.43,77.34 88.72,76.63 82.86,76.63 81.08,74.85 80.01,74.85 76.28,78.59 RN2.3 | 119.48,88.9 IC16.5
  Bottom 0.152: v161.98,80.37 161.98,81.25 160.38,82.86 158.06,82.86 152.55,88.37 152.55,88.9 IC22.5 | IC16.5 124.64,88.9 v125.53,88.01 | v139.04,87.48 142.06,90.5 151.49,90.5 152.38,91.39 IC22.4 | v49.61,73.97 50.49,73.97 50.85,73.61 60.45,73.61 64.9,78.05 68.45,78.05 70.76,80.37 74.5,80.37 76.1,78.77 RN2.3 | IC24.4 151.13,26.67 142.24,26.67 139.93,28.98 126.06,28.98 125.17,28.09 119.48,28.09 IC18.4 119.3,27.91 118.42,27.03 109.53,27.03 108.99,27.56 108.99,27.74 v106.86,29.87 | v49.96,36.45 v66.32,36.45 70.23,36.45 76.28,30.4 v95.83,30.4 | v54.23,67.56 60.1,67.56 66.32,61.34 v66.32,44.63 | v110.41,68.63 108.99,67.21 108.99,67.03 108.28,66.32 107.57,66.32 106.32,67.56 106.32,67.74 v97.97,76.1
ADATA10  (via drill 0.33)
  Top 0.152: IC9.16 48.36,40.72 48.36,41.96 53.34,46.94 IC4.7 | v54.41,74.85 53.87,74.85 48.9,69.88 48.36,69.88 IC8.16 | v50.67,60.45 v54.94,60.45 | IC18.7 119.48,20.45 119.48,22.76 IC18.6 | IC24.6 152.38,22.76 152.38,20.45 IC24.7 152.38,20.27 152.38,19.74 150.77,18.14 150.77,14.94 152.02,13.69 156.46,13.69 158.78,11.38 161.26,11.38 176.56,26.67 v176.56,60.98 | IC16.7 119.48,83.92 119.48,86.23 IC16.6 | IC22.7 152.38,83.92 152.38,86.23 IC22.6 | v158.06,83.74 158.95,82.86 160.38,82.86 162.69,80.54 162.69,75.74 168.38,70.05 171.58,70.05 172.64,68.99 172.64,68.28 171.58,67.21 171.58,66.14 JP5.8 | v90.86,43.2 93.34,43.2 102.59,33.96 103.83,33.96 104.72,33.07 v104.72,30.23
  Bottom 0.152: v54.41,74.85 54.41,76.63 56.19,78.41 68.28,78.41 70.59,80.72 76.63,80.72 78.59,78.77 RN2.4 | v54.94,60.45 56.9,58.5 56.9,54.23 61.87,49.25 61.87,45.52 60.81,44.45 56.54,44.45 54.05,46.94 53.34,46.94 IC4.7 | v50.67,60.45 49.25,61.87 49.25,63.12 48.18,64.19 47.3,64.19 46.76,64.72 46.76,68.28 48.18,69.7 IC8.16 | IC18.7 119.48,20.27 125.17,20.27 126.06,19.38 132.46,19.38 134.42,21.34 151.49,21.34 152.38,20.45 IC24.7 | v158.06,83.74 158.06,85.17 153.44,89.79 151.31,89.79 150.77,89.26 | 150.77,89.26 150.77,88.01 152.38,86.41 IC22.6 | 150.77,89.26 149.88,90.14 142.24,90.14 141.53,89.43 141.53,87.48 136.91,82.86 134.95,82.86 132.99,84.81 126.06,84.81 125.17,83.92 119.48,83.92 IC16.7 | v176.56,60.98 171.58,65.96 JP5.8 | v90.86,43.2 51.38,43.2 48.9,40.72 48.36,40.72 IC9.16 | v104.72,30.23 104.72,29.16 110.06,23.82 118.42,23.82 IC18.6
ADATA11  (via drill 0.33)
  Top 0.152: IC9.15 50.85,40.54 51.56,40.54 52.98,39.12 53.7,39.12 54.94,40.36 54.94,46.05 IC4.8 56.01,47.12 56.01,49.78 59.74,53.52 59.74,55.83 59.03,56.54 v52.45,56.54 | v54.59,77.7 54.59,75.56 55.12,75.03 55.12,74.68 50.85,70.41 50.85,69.88 IC8.15 | IC18.9 119.48,15.29 119.48,17.78 IC18.8 | IC24.9 152.38,15.29 152.38,17.78 IC24.8 152.55,17.78 152.55,18.49 158.42,24.36 158.42,28.27 159.66,29.52 161.09,29.52 162.51,30.94 v162.51,32.18 | IC16.9 119.48,78.77 119.48,81.25 IC16.8 | IC22.8 152.38,81.25 152.38,78.77 IC22.9 152.38,78.59 151.31,77.52 v145.8,77.52 | v172.47,62.05 172.47,62.59 171.58,63.48 JP5.10 | v95.83,78.41 93.88,80.37 83.57,80.37 81.97,78.77 81.43,78.77 RN2.5
  Bottom 0.152: v52.45,56.54 52.45,65.61 50.85,67.21 50.85,69.7 IC8.15 | v54.59,77.7 55.65,78.77 64.9,78.77 67.21,81.08 76.81,81.08 76.99,80.9 78.59,80.9 80.72,78.77 81.25,78.77 RN2.5 | IC18.9 119.48,15.11 125.17,15.11 126.06,14.22 151.49,14.22 152.38,15.11 IC24.9 | JP5.10 171.4,63.65 170.33,63.65 169.44,64.54 168.38,64.54 154.33,78.59 154.33,79.48 152.55,81.25 IC22.8 | 119.48,78.05 119.48,78.59 IC16.9 | 119.48,78.05 120.55,76.99 125.88,76.99 126.24,77.34 139.57,77.34 139.93,77.7 145.62,77.7 v145.8,77.52 | v162.51,32.18 165,32.18 175.13,42.32 175.13,59.38 v172.47,62.05 | v95.83,78.41 96.9,78.41 97.08,78.59 100.99,78.59 101.88,77.7 119.13,77.7 119.48,78.05
ADATA12  (via drill 0.33)
  Top 0.152: IC9.14 53.34,44.98 54.94,46.58 54.94,49.25 59.38,53.7 59.38,55.65 58.85,56.19 57.43,56.19 56.01,54.76 IC4.13 | IC8.14 53.34,69.34 56.01,66.67 v56.01,64.01 | v61.7,71.65 v63.83,73.79 | 127.13,17.78 127.13,15.29 IC18.12 | IC24.13 IC24.12 160.02,14.58 158.42,12.98 158.42,12.27 158.95,11.73 161.09,11.73 174.07,24.71 174.07,49.43 v173.71,49.78 | IC16.12 127.13,78.77 127.13,81.25 IC16.13 | IC22.13 IC22.12 160.02,78.59 161.62,76.99 161.62,74.32 168.55,67.39 169.09,67.39 169.98,66.5 169.98,63.48 171.4,62.05 171.4,60.98 JP5.12 | v145.44,78.41 147.57,78.41 151.49,82.32 v155.4,82.32 | v129.62,49.96 129.62,28.8 130.33,28.09 130.33,20.98 127.13,17.78 | 127.13,17.78 IC18.13
  Bottom 0.152: v56.01,64.01 55.65,64.01 54.59,62.94 54.59,60.98 54.23,60.63 54.23,56.36 55.83,54.76 IC4.13 | 78.94,74.5 78.59,74.14 67.03,74.14 66.32,73.43 64.19,73.43 v63.83,73.79 | 78.94,74.5 83.03,78.59 83.74,78.59 RN2.6 | v61.7,71.65 55.12,71.65 53.34,69.88 IC8.14 | IC24.13 159.13,16.89 135.66,16.89 134.06,15.29 127.13,15.29 IC18.12 | v145.44,78.41 145.44,78.77 144.55,79.65 129.97,79.65 128.37,81.25 127.13,81.25 IC16.13 | v155.4,82.32 159.13,82.32 160.02,81.43 IC22.13 | v173.71,49.78 173.71,58.67 171.58,60.81 JP5.12 | 78.94,74.5 81.61,71.83 84.99,71.83 88.01,68.81 88.01,66.32 102.59,51.74 107.57,51.74 109.53,49.78 129.44,49.78 v129.62,49.96
ADATA13  (via drill 0.33)
  Top 0.152: v57.78,50.49 57.78,48.36 56.9,47.47 56.9,41.6 56.01,40.72 IC9.13 | v56.72,65.61 56.72,66.5 56.01,67.21 56.01,69.7 IC8.13 55.83,69.88 54.23,71.48 52.98,71.48 52.45,70.94 52.45,69.52 51.21,68.28 47.83,68.28 47.3,68.81 47.3,70.76 52.09,75.56 v52.09,76.99 | IC18.14 127.13,20.45 127.13,22.76 IC18.15 | IC24.14 IC24.15 160.02,22.94 166.42,22.94 173,29.52 v173,42.32 | IC16.14 127.13,83.92 127.13,86.23 IC16.15 | IC22.15 IC22.14 | v166.24,77.52 169.09,77.52 173.18,73.43 173.18,61.16 171.58,59.56 171.58,58.5 JP5.14 | v91.57,42.49 101.35,32.72 101.35,32.54 v102.06,31.83
  Bottom 0.152: v57.78,50.49 53.7,54.59 53.34,54.59 IC4.14 53.34,60.27 54.23,61.16 54.23,63.12 v56.72,65.61 | v52.09,76.99 54.23,79.12 64.72,79.12 67.03,81.43 76.99,81.43 77.17,81.25 83.21,81.25 85.7,78.77 86.23,78.77 RN2.7 | IC18.14 127.13,20.45 132.99,20.45 134.42,21.87 159.13,21.87 160.02,22.76 IC24.15 | 163.22,80.54 160.02,83.74 IC22.14 | 163.22,80.54 v166.24,77.52 | 163.22,80.54 162.33,79.65 157.18,79.65 154.51,82.32 152.02,82.32 144.55,89.79 142.42,89.79 141.88,89.26 141.88,87.3 137.08,82.5 134.77,82.5 133.53,83.74 127.13,83.74 IC16.14 | v173,42.32 173,56.9 171.58,58.32 JP5.14 | v91.57,42.49 58.32,42.49 56.54,40.72 56.01,40.72 IC9.13 | v102.06,31.83 104.01,31.83 109.53,26.31 123.57,26.31 126.95,22.94 IC18.15
ADATA14  (via drill 0.33)
  Top 0.152: v65.96,62.59 61.34,57.96 49.61,57.96 46.41,54.76 45.87,54.76 IC4.17 | v62.23,41.78 62.23,51.92 v67.03,56.72 | 88.9,78.59 88.19,78.59 86.77,77.17 v79.48,77.17 | v63.12,74.5 58.5,69.88 IC8.12 | IC16.16 127.13,88.9 127.13,91.39 IC16.17 126.95,91.57 126.95,92.1 125.35,93.7 125.35,96.9 | IC22.16 IC22.17 160.02,91.57 161.62,93.17 161.62,96.9 161.09,97.43 159.66,97.43 156.64,100.46 134.77,100.46 132.46,98.15 126.59,98.15 125.35,96.9 | IC18.16 127.13,25.43 127.13,27.91 IC18.17 | IC24.17 IC24.16 | v175.13,40.89 175.13,51.21 171.58,54.76 171.58,55.83 JP5.16 173.53,57.96 173.53,73.61 168.91,78.23 v167.84,78.23 | 88.9,78.59 89.61,78.59 91.03,77.17 v101.52,77.17 | v117.53,74.85 120.55,74.85 123.39,77.7 123.39,96.72 123.93,97.26 124.99,97.26 125.35,96.9 | 88.9,78.59 RN2.8
  Bottom 0.152: IC8.12 58.5,69.7 65.61,62.59 v65.96,62.59 67.03,61.52 v67.03,56.72 | v62.23,41.78 61.87,42.14 60.45,42.14 59.03,40.72 58.5,40.72 IC9.12 | v79.48,77.17 72.72,77.17 70.05,74.5 66.85,74.5 66.14,73.79 64.72,73.79 64.01,74.5 v63.12,74.5 | v175.13,40.89 174.78,40.89 161.98,28.09 160.02,28.09 IC24.17 | IC18.16 127.13,25.25 134.06,25.25 134.95,24.36 159.13,24.36 160.02,25.25 IC24.16 | IC22.16 167.84,81.08 v167.84,78.23 | v101.52,77.17 115.21,77.17 v117.53,74.85
ADATA15  (via drill 0.33)
  Top 0.152: v60.63,45.16 60.81,44.98 60.81,40.72 IC9.11 | v81.79,72.54 72.36,72.54 69.34,69.52 v67.92,69.52 | IC16.18 127.13,94.06 127.13,96.37 IC16.19 127.13,96.55 131.39,96.55 134.95,100.1 156.46,100.1 160.02,96.55 IC22.19 IC22.18 160.02,93.34 157.35,90.68 157.35,69.34 162.33,64.36 162.33,60.98 v167.49,55.83 | IC18.19 127.13,32.89 127.13,30.58 IC18.18 127.13,30.4 v129.62,27.91 | IC24.19 IC24.18 | v174.42,50.49 171.58,53.34 JP5.18 | v109.17,82.32 110.95,82.32 114.5,85.88 114.5,96.19 118.42,100.1 v121.97,100.1
  Bottom 0.152: 51.74,52.27 50.49,51.03 50.14,51.03 49.07,52.09 46.23,52.09 43.74,54.59 43.2,54.59 IC4.18 | 51.74,52.27 51.74,65.79 49.78,67.74 49.78,70.76 51.38,72.36 61.87,72.36 62.41,71.83 62.41,71.3 | IC8.11 62.41,71.3 | v60.63,45.16 59.38,46.41 59.38,48.01 55.12,52.27 51.74,52.27 | v81.79,72.54 82.14,72.19 90.68,72.19 91.39,72.9 91.39,78.59 RN2.9 91.57,78.77 95.3,78.77 98.86,82.32 v109.17,82.32 | v67.92,69.52 64.19,69.52 62.41,71.3 | v174.42,50.49 174.42,42.14 165.35,33.07 160.02,33.07 IC24.19 | v129.62,27.91 133.88,27.91 135.48,26.31 155.93,26.31 160.02,30.4 IC24.18 | v167.49,55.83 168.91,54.41 170.33,54.41 171.4,53.34 JP5.18 | v121.97,100.1 123.39,100.1 126.95,96.55 IC16.19
ADDR0
  Top 0.152: IC3.2 40.54,19.2 39.83,19.2 35.92,23.11 11.38,23.11 10.13,24.36 6.04,24.36 5.16,25.25 X1.A4
ADDR1
  Top 0.152: IC3.5 48.18,19.2 47.47,19.2 43.38,23.29 36.45,23.29 32.89,26.85 6.22,26.85 5.16,27.91 X1.A5
ADDR2
  Top 0.152: X1.A6 6.22,29.34 30.94,29.34 36.63,23.65 45.7,23.65 50.14,19.2 50.67,19.2 IC3.6
ADDR3
  Top 0.152: IC3.9 58.32,19.2 57.61,19.2 52.81,24 36.8,24 28.98,31.83 6.22,31.83 5.16,32.89 X1.A7
ADDR4
  Top 0.152: IC3.12 57.78,26.67 55.47,24.36 37.34,24.36 35.74,25.96 35.74,27.2 28.45,34.49 6.22,34.49 5.16,35.56 X1.A8
ADDR5
  Top 0.152: IC3.15 50.67,26.67 48.72,24.71 37.52,24.71 36.09,26.14 36.09,27.38 26.49,36.98 6.22,36.98 5.16,38.05 X1.A9
ADDR6  (via drill 0.33)
  Top 0.152: IC3.16 47.65,26.67 42.85,31.47 40.18,31.47 39.47,32.18 39.47,34.85 34.85,39.47 16,39.47 10.85,44.63 6.76,44.63 v6.4,44.98
  Bottom 0.152: v6.4,44.98 6.4,41.96 X1.A10
ADDR7
  Top 0.152: IC3.19 40.54,26.67 40.54,30.58 39.12,32 39.12,34.67 34.67,39.12 15.82,39.12 10.67,44.27 6.22,44.27 5.16,43.2 X1.A11
ADDR8  (via drill 0.33)
  Top 0.152: v33.43,46.76 35.2,48.54 38.58,48.54 40.01,47.12 40.54,47.12 IC4.2
  Bottom 0.152: v33.43,46.76 6.04,46.76 5.16,45.87 X1.A12
ADDR9
  Top 0.152: IC4.5 48.18,47.12 44.81,50.49 11.91,50.49 10.85,49.43 6.22,49.43 5.16,48.36 X1.A13
ADDR10  (via drill 0.33)
  Top 0.152: v11.38,49.07 14.94,49.07 15.47,48.54 34.67,48.54 35.03,48.9 45.7,48.9 46.76,47.83 46.76,46.58 48.01,45.34 48.54,45.34 50.14,46.94 50.67,46.94 IC4.6
  Bottom 0.152: v11.38,49.07 10.85,49.07 10.31,49.61 6.76,49.61 5.69,50.67 5.16,50.67 X1.A14
ADDR11
  Bottom 0.152: IC4.9 58.32,47.12 57.78,47.12 54.23,50.67 12.8,50.67 11.2,52.27 6.22,52.27 5.16,53.34 X1.A15
ADDR12
  Top 0.152: IC4.12 58.32,54.59 57.78,54.59 55.65,52.45 49.07,52.45 47.65,51.03 14.05,51.03 10.31,54.76 6.22,54.76 5.16,55.83 X1.A16
ADDR13
  Top 0.152: IC4.15 50.67,54.59 48.72,52.63 35.03,52.63 30.4,57.25 6.22,57.25 5.16,58.32 X1.A17
ADDR14
  Bottom 0.152: IC4.16 48.18,54.76 47.47,54.76 43.74,58.5 11.56,58.5 10.13,59.92 6.04,59.92 5.16,60.81 X1.A18
ADDR15
  Top 0.152: IC4.19 40.54,54.76 39.83,54.76 36.63,57.96 35.92,57.96 31.47,62.41 6.22,62.41 5.16,63.48 X1.A19
ADDR-REG-CLK  (via drill 0.33)
  Top 0.152: v90.68,37.52 87.3,34.14 87.3,29.34 v84.45,26.49
  Bottom 0.152: v90.68,37.52 92.46,39.29 92.46,42.49 90.5,44.45 90.5,47.3 85.34,52.45 85.34,55.12 84.28,56.19 81.61,56.19 77.7,60.1 77.7,61.87 83.74,67.92 83.74,68.45 IC1.11 | v84.45,26.49 83.39,26.49 68.63,11.73 68.63,11.56 61.52,4.45 41.07,4.45 34.67,10.85 14.94,10.85 8.71,17.07 8.71,24.18 7.64,25.25 X1.B4
ADDR-REG-OUT  (via drill 0.33)
  Top 0.152: IC6.5 86.23,33.07 83.92,33.07 IC6.4 83.74,32.89 83.74,18.67 82.14,17.07 57.96,17.07 57.78,17.25 v57.43,17.25
  Bottom 0.152: X1.B8 8.53,35.56 9.96,34.14 18.31,34.14 35.74,16.71 56.9,16.71 v57.43,17.25
BRD-ADDR-REG0
  Bottom 0.152: 45.87,11.56 45.87,6.4 IC2.2 | 45.87,11.56 48.18,13.87 IC2.14 | 45.87,11.56 44.98,12.45 38.94,12.45 27.38,24 9.96,24 9.07,24.89 9.07,25.43 8,26.49 7.47,26.49 6.58,27.38 6.58,28.45 7.47,29.34 7.47,30.4 X1.B6
BRD-ADDR-REG1
  Bottom 0.152: IC2.3 48.36,6.4 48.36,11.56 50.67,13.87 IC2.13 50.67,14.05 49.25,15.47 36.45,15.47 25.43,26.49 10.13,26.49 8.71,27.91 7.64,27.91 X1.B5
BRD-IN-ID0  (via drill 0.33)
  Top 0.152: v28.98,90.14 28.98,81.08 v35.2,74.85
  Bottom 0.152: v28.98,90.14 36.09,97.26 45.7,97.26 47.65,95.3 48.18,95.3 IC12.14 | v35.2,74.85 31.47,71.12 19.91,71.12 10.85,62.05 8.71,62.05 X1.B18
BRD-IN-ID1  (via drill 0.33)
  Top 0.152: v12.8,67.21 v16.54,70.94
  Bottom 0.152: v16.54,70.94 20.09,74.5 33.25,74.5 41.6,82.86 41.6,84.28 42.67,85.34 42.85,85.34 44.09,86.59 44.09,88.01 50.67,94.59 50.67,95.12 IC12.13 | v12.8,67.21 10.13,64.54 8.53,64.54 7.64,63.65 X1.B19
BRD-OUT-ID0
  Bottom 0.152: IC11.14 48.36,107.92 48.9,107.92 50.49,106.32 53.7,106.32 54.23,106.86 54.23,108.99 50.85,112.37 16.18,112.37 12.8,108.99 4.62,108.99 3.91,108.28 3.91,104.9 5.87,102.95 5.87,98.86 0.71,93.7 0.71,56.19 4.98,51.92 6.4,51.92 7.47,50.85 X1.B14
BRD-OUT-ID1  (via drill 0.33)
  Top 0.152: v14.05,102.59 9.6,102.59 3.2,96.19 v3.2,67.56
  Bottom 0.152: v14.05,102.59 18.85,107.39 18.85,110.59 19.91,111.66 46.58,111.66 50.14,108.1 50.67,108.1 IC11.13 | v3.2,67.56 3.2,58.67 4.8,57.07 5.51,57.07 6.58,56.01 6.58,54.23 7.47,53.34 X1.B15
CLK0H  (via drill 0.33)
  Top 0.152: v127.48,68.1 127.48,75.74 127.13,76.1 IC16.11 | v120.9,46.23 120.9,54.41 119.48,55.83 IC14.4
  Bottom 0.152: v127.48,68.1 127.48,65.08 128.55,64.01 128.55,63.12 128.02,62.59 126.59,62.59 120.02,56.01 119.48,56.01 IC14.4 | JP5.23 168.91,45.16 161.62,37.87 161.62,35.2 161.09,34.67 125.35,34.67 120.9,39.12 v120.9,46.23
CLK0L
  Bottom 0.152: IC15.11 110.59,76.1 110.59,72.36 119.3,63.65 IC14.1 119.48,63.65 122.15,63.65 131.39,72.9 135.66,72.9 140.11,77.34 144.37,77.34 145.09,76.63 145.09,73.61 158.78,59.92 160.55,59.92 168.2,52.27 168.91,52.27 169.98,51.21 169.98,50.67 171.04,49.61 171.58,49.61 172.64,48.54 172.64,45.34 171.93,44.63 171.4,44.63 169.98,43.2 168.91,43.2 JP5.25
CLK1H  (via drill 0.33)
  Top 0.152: IC18.11 126.95,12.8 126.95,13.34 125.35,14.94 125.35,38.41 128.91,41.96 128.91,59.03 127.13,60.81 IC14.13 | v149.17,54.76 v153.8,54.76
  Bottom 0.152: v153.8,54.76 160.55,54.76 164.47,50.85 168.91,50.85 JP5.19 | v149.17,54.76 144.55,59.38 138.86,59.38 136.91,57.43 126.06,57.43 125.35,58.14 125.35,59.21 126.95,60.81 IC14.13
CLK1L
  Top 0.152: IC17.11 110.59,12.8 110.59,13.34 117.88,20.62 117.88,28.45 118.95,29.52 120.37,29.52 124.99,34.14 124.99,38.58 128.55,42.14 128.55,51.92 127.13,53.34 IC14.10
  Bottom 0.152: JP5.21 168.91,48.36 161.8,48.36 160.91,49.25 139.4,49.25 136.19,52.45 128.02,52.45 127.13,53.34 IC14.10
CLK2H
  Top 0.152: IC22.11 160.02,70.76 168.73,62.05 169.44,62.05 170.33,61.16 170.33,47.65 171.4,46.58 171.4,45.87 JP5.24
  Bottom 0.152: IC20.4 136.02,56.01 141.71,56.01 142.6,56.9 144.37,56.9 151.66,49.61 162.87,49.61 163.4,49.07 168.2,49.07 168.55,49.43 169.27,49.43 170.33,48.36 170.33,47.65 171.4,46.58 171.4,45.87 JP5.24
CLK2L  (via drill 0.33)
  Top 0.152: v167.84,49.78 167.84,47.83 168.55,47.12 169.09,47.12 169.98,46.23 169.98,45.7 171.4,44.27 171.4,43.2 JP5.26
  Bottom 0.152: IC20.1 136.02,63.65 136.02,72.36 140.64,76.99 142.77,76.99 143.49,76.28 IC21.11 143.66,76.1 143.66,74.5 153.97,64.19 153.97,60.63 153.26,59.92 152.02,59.92 150.77,58.67 150.77,55.47 151.31,54.94 152.73,54.94 155.22,52.45 160.55,52.45 163.22,49.78 v167.84,49.78
CLK3H  (via drill 0.33)
  Top 0.152: v155.4,65.25 155.4,59.38 153.44,57.43 151.49,57.43 148.11,60.81 143.66,60.81 IC20.13 | IC24.11 160.02,13.34 173.71,27.03 173.71,48.54 JP5.20
  Bottom 0.152: v155.4,65.25 156.29,65.25 159.13,62.41 169.09,62.41 170.33,61.16 170.33,55.47 171.4,54.41 171.93,54.41 172.64,53.7 172.64,51.92 171.58,50.85 JP5.20
CLK3L
  Top 0.152: 138.15,34.67 138.15,38.23 137.44,38.94 137.44,47.3 143.49,53.34 IC20.10 | 138.15,34.67 138.15,18.67 143.49,13.34 143.49,12.8 IC23.11 | 138.15,34.67 154.15,34.67 161.26,41.78 171.58,41.78 172.64,42.85 172.64,46.05 171.58,47.12 171.58,48.18 JP5.22
DATA0  (via drill 0.33)
  Top 0.152: v38.05,34.85 36.27,34.85 32.36,38.76 13.51,38.76 10.13,42.14 4.62,42.14 2.67,44.09 2.67,63.65 4.98,65.96 X1.A20 5.16,66.14 6.22,67.21 10.49,67.21 11.2,66.5 v16.18,66.5
  Bottom 0.152: v38.05,34.85 38.23,34.85 40.01,33.07 40.54,33.07 IC9.2 | v16.18,66.5 28.45,66.5 34.14,72.19 36.09,72.19 40.01,76.1 40.54,76.1 IC7.2
DATA1  (via drill 0.33)
  Top 0.152: v4.09,46.76 10.67,46.76 17.6,39.83 35.03,39.83 36.09,38.76 36.8,38.76 42.49,33.07 43.03,33.07 IC9.3 | v1.6,49.25 1.6,65.08 4.98,68.45 X1.A21 | v32.72,73.79 40.18,73.79 42.49,76.1 43.03,76.1 IC7.3
  Bottom 0.152: v1.6,49.25 v4.09,46.76 | v32.72,73.79 20.27,73.79 16.71,70.23 12.62,70.23 10.67,72.19 4.62,72.19 3.91,71.48 3.91,69.7 4.98,68.63 X1.A21
DATA2  (via drill 0.33)
  Top 0.152: v5.87,64.9 4.98,64.9 3.02,62.94 3.02,48.72 4.62,47.12 10.49,47.12 12.09,48.72 14.76,48.72 18.14,45.34 38.41,45.34 41.6,42.14 41.6,40.18 42.67,39.12 44.09,39.12 49.25,33.96 49.25,32 48.72,31.47 47.83,31.47 46.41,32.89 45.87,32.89 IC9.4 | v31.11,79.83 34.49,79.83 36.27,78.05 43.92,78.05 45.7,76.28 IC7.4
  Bottom 0.152: v5.87,64.9 5.87,65.25 6.22,65.61 6.22,67.39 | 6.22,67.39 6.22,70.05 5.16,71.12 X1.A22 | v31.11,79.83 9.78,79.83 8.71,78.77 8.71,73.25 8,72.54 4.45,72.54 3.56,71.65 3.56,68.63 4.8,67.39 6.22,67.39
DATA3  (via drill 0.33)
  Top 0.152: v14.58,48.01 22.4,40.18 35.2,40.18 36.27,39.12 41.6,39.12 47.65,33.07 48.18,33.07 IC9.5 | v11.56,51.03 10.31,52.27 7.11,52.27 6.22,53.16 6.22,53.7 5.16,54.76 4.62,54.76 3.91,55.47 3.91,62.05 | v3.91,62.76 3.91,62.05 | v24.18,61.7 11.02,61.7 10.67,62.05 3.91,62.05
  Bottom 0.152: v11.56,51.03 v14.58,48.01 | v3.91,62.76 3.91,67.74 3.2,68.45 3.2,71.83 4.98,73.61 X1.A23 | v24.18,61.7 34.31,71.83 38.23,71.83 41.6,75.21 41.6,76.63 44.09,79.12 44.81,79.12 47.65,76.28 48.18,76.28 IC7.5
DATA4  (via drill 0.33)
  Top 0.152: v67.03,38.41 67.03,49.43 v70.94,53.34 | v63.65,79.83 v70.05,73.43 | v48.18,80.72 39.29,80.72 37.16,82.86 37.16,83.92 25.96,95.12 4.62,95.12 3.56,94.06 3.56,78.23 4.98,76.81 4.98,76.28 X1.A24
  Bottom 0.152: v67.03,38.41 51.03,38.41 49.25,36.63 49.25,36.27 50.67,34.85 50.67,33.07 IC9.6 | v70.94,53.34 70.94,72.54 v70.05,73.43 | v63.65,79.83 54.05,79.83 51.56,77.34 | 51.56,77.34 50.85,76.63 50.85,76.28 IC7.6 | 51.56,77.34 v48.18,80.72
DATA5  (via drill 0.33)
  Top 0.152: v60.63,35.74 60.63,38.41 62.94,40.72 v62.94,50.67 | v54.05,66.32 51.74,66.32 51.21,66.85 v49.78,66.85 | v49.43,72.01 53.34,75.92 IC7.7 | v47.47,64.9 46.58,65.79 38.23,65.79 26.67,77.34 7.47,77.34 6.22,78.59 5.16,78.59 X1.A25
  Bottom 0.152: v60.63,35.74 56.72,35.74 54.05,33.07 53.34,33.07 IC9.7 | v62.94,50.67 59.38,54.23 59.38,57.43 57.25,59.56 57.25,65.25 57.43,65.43 57.43,65.79 56.9,66.32 v54.05,66.32 | v49.43,72.01 49.43,67.56 49.78,67.21 v49.78,66.85 47.83,64.9 v47.47,64.9
DATA6  (via drill 0.33)
  Top 0.152: v38.41,38.05 40.18,38.05 44.09,34.14 44.09,32.72 45.7,31.11 53.34,31.11 55.12,32.89 55.83,32.89 IC9.8 | v35.03,27.03 34.31,27.03 27.2,34.14 4.98,34.14 0.89,38.23 0.89,77.17 v1.78,78.05 | v29.69,82.32 36.09,82.32 39.12,79.3 53.87,79.3 55.83,77.34 55.83,76.28 IC7.8
  Bottom 0.152: v38.41,38.05 38.41,36.63 35.03,33.25 v35.03,27.03 | v1.78,78.05 4.98,81.25 X1.A26 5.16,81.43 6.04,82.32 v29.69,82.32
DATA7  (via drill 0.33)
  Top 0.152: IC9.9 58.32,32.89 57.78,32.89 53.16,28.27 50.49,28.27 49.25,27.03 49.25,25.78 48.54,25.07 37.69,25.07 36.45,26.31 36.45,27.56 25.6,38.41 11.38,38.41 10.31,39.47 7.29,39.47 6.22,40.54 6.22,41.07 5.51,41.78 4.45,41.78 2.31,43.92 2.31,64.9 4.8,67.39 5.51,67.39 6.22,68.1 6.22,76.63 5.16,77.7 4.62,77.7 3.91,78.41 3.91,82.68 4.98,83.74 X1.A27 | v64.9,67.03 64.9,74.14 61.34,77.7 60.45,77.7 59.03,76.28 58.5,76.28 IC7.9 | v67.74,51.92 67.74,51.56 63.3,47.12 63.3,37.52 v60.63,34.85
  Bottom 0.152: v64.9,67.03 64.9,64.54 67.74,61.7 v67.74,51.92 | v60.63,34.85 60.27,34.85 58.5,33.07 IC9.9
DATA8
  Top 0.152: IC8.2 40.54,62.23 35.2,67.56 35.2,67.74 29.34,73.61 10.31,73.61 X1.C23
DATA9
  Top 0.152: IC8.3 42.67,62.23 39.47,65.43 38.05,65.43 27.38,76.1 10.31,76.1 X1.C24
DATA10  (via drill 0.33)
  Top 0.152: v35.03,63.83 31.65,63.83 22.58,72.9 v16,72.9
  Bottom 0.152: IC8.4 45.16,62.23 43.56,63.83 v35.03,63.83 | X1.C25 v16,72.9
DATA11
  Top 0.152: IC8.5 48.18,62.23 48.18,65.08 45.7,67.56 36.98,67.56 23.29,81.25 10.31,81.25 X1.C26
DATA12
  Top 0.152: IC8.6 50.67,62.23 50.67,63.12 45.87,67.92 37.16,67.92 21.34,83.74 10.31,83.74 X1.C27
DATA13  (via drill 0.33)
  Top 0.152: v56.72,68.28 56.72,68.81 56.9,68.99 56.9,73.08 v55.65,74.32 | v39.29,76.81 39.29,75.39 38.05,74.14 33.25,74.14 17.42,89.97 9.6,89.97 9.07,89.43 9.07,87.48 10.13,86.41 X1.C28
  Bottom 0.152: IC8.7 53.34,67.56 54.05,68.28 v56.72,68.28 | v55.65,74.32 54.76,74.32 54.59,74.14 50.85,74.14 49.25,75.74 49.25,77.17 48.54,77.88 46.58,77.88 44.98,79.48 41.96,79.48 v39.29,76.81
DATA14
  Top 0.152: IC8.8 55.3,62.23 51.38,66.14 48.18,66.14 46.05,68.28 37.34,68.28 16.71,88.9 X1.C29
DATA15
  Top 0.152: IC8.9 58.32,62.23 58.32,67.92 57.25,68.99 57.25,76.81 54.41,79.65 39.29,79.65 29.69,89.26 29.69,90.32 28.63,91.39 10.31,91.39 X1.C30
DATA-REG-IN-ID0
  Bottom 0.152: IC12.2 45.7,87.48 45.7,85.7 44.09,84.1 44.09,82.86 38.94,77.7 37.16,77.7 33.43,73.97 33.43,73.61 31.29,71.48 19.74,71.48 10.67,62.41 4.98,62.41 3.91,61.34 3.91,60.63 4.98,59.56 5.51,59.56 6.58,58.5 6.58,56.9 7.47,56.01 X1.B16
DATA-REG-IN-ID1  (via drill 0.33)
  Top 0.152: v47.3,78.59 47.3,75.74 v43.2,71.65 | v22.94,59.56 8.71,59.56 7.64,58.5 X1.B17
  Bottom 0.152: v47.3,78.59 47.3,84.81 48.18,85.7 48.18,87.48 IC12.3 | v43.2,71.65 38.58,71.65 38.41,71.48 34.85,71.48 v22.94,59.56
DATA-REG-OUT-ID0  (via drill 0.33)
  Top 0.152: v38.58,94.41 39.29,94.41 45.16,100.28 45.7,100.28 IC11.2 | v37.69,79.83 38.05,79.83 39.47,78.41 v44.45,78.41 | v70.05,51.38 70.05,36.63 v67.21,33.78
  Bottom 0.152: v38.58,94.41 38.94,94.41 40.36,92.99 40.36,85.52 39.47,84.63 39.47,81.61 v37.69,79.83 | v44.45,78.41 44.45,75.39 47.12,72.72 66.32,72.72 69.34,69.7 69.34,52.09 v70.05,51.38 | v67.21,33.78 67.21,26.31 65.43,24.54 44.09,24.54 39.12,19.56 39.12,18.14 38.41,17.42 36.09,17.42 11.2,42.32 11.2,43.74 10.31,44.63 8.71,44.63 X1.B12
DATA-REG-OUT-ID1  (via drill 0.33)
  Top 0.152: v36.63,93.7 39.12,93.7 42.32,96.9 44.27,96.9 47.65,100.28 48.18,100.28 IC11.3 | v3.73,50.67 v3.73,54.05
  Bottom 0.152: v36.63,93.7 35.56,93.7 24.54,82.68 4.98,82.68 1.07,78.77 1.07,56.72 v3.73,54.05 | v3.73,50.67 4.98,49.43 6.4,49.43 7.47,48.36 X1.B13
DATA-REG-RD-HI
  Top 0.152: IC1.5 86.23,60.98 86.23,64.19 82.68,67.74 82.68,72.54 81.97,73.25 72.54,73.25 69.52,70.23 67.74,70.23 65.61,68.1 65.61,66.85 62.94,64.19 60.45,64.19 59.38,63.12 59.38,59.74 58.32,58.67 36.27,58.67 22.76,72.19 8.71,72.19 7.64,71.12 X1.B22
DATA-REG-RD-LO
  Top 0.152: IC1.1 76.28,60.98 76.28,61.7 82.32,67.74 82.32,69.52 81.61,70.23 70.59,70.23 64.19,63.83 60.63,63.83 59.74,62.94 59.74,59.56 58.5,58.32 36.09,58.32 29.52,64.9 8.71,64.9 7.64,65.96 X1.B20
DATA-REG-WR-HI  (via drill 0.33)
  Top 0.152: IC1.9 88.9,75.56 v89.97,76.63 | v11.56,109.7 11.91,109.7 12.62,108.99 13.16,108.99 13.87,108.28 13.87,107.39 2.49,96.01 v2.49,77.17
  Bottom 0.152: v89.97,76.63 89.97,79.3 96.01,85.34 103.83,85.34 104.37,85.88 104.37,86.77 103.12,88.01 93.52,88.01 68.81,112.72 13.34,112.72 11.56,110.95 v11.56,109.7 | v2.49,77.17 4.8,74.85 6.4,74.85 7.47,73.79 X1.B23
DATA-REG-WR-LO  (via drill 0.33)
  Top 0.152: v64.54,79.83 v70.94,73.43 | v49.07,92.1 49.07,92.46 46.76,94.77 46.76,96.19 46.05,96.9 45.34,96.9 44.09,95.66 44.09,92.46 v39.12,87.48 | v14.94,70.94 11.56,70.94 10.31,69.7 8.71,69.7 7.64,68.63 X1.B21
  Bottom 0.152: v70.94,73.43 72.9,71.48 82.86,71.48 84.81,69.52 84.81,67.56 81.43,64.19 81.43,60.98 IC1.3 | v64.54,79.83 62.76,81.61 53.52,81.61 51.74,83.39 51.74,84.81 49.25,87.3 49.25,90.32 49.07,90.5 v49.07,92.1 | v39.12,87.48 39.12,82.14 31.83,74.85 18.85,74.85 v14.94,70.94
DIR  (via drill 0.33)
  Top 0.152: v31.47,70.41 31.47,68.81 33.96,66.32 34.14,66.32 35.2,65.25 35.2,65.08 38.05,62.23 IC8.1 | v50.32,51.74 50.32,49.43 51.74,48.01 51.74,46.05 47.3,41.6 47.3,39.65 48.54,38.41 v49.07,38.41
  Bottom 0.152: v31.47,70.41 31.83,70.41 37.52,76.1 38.05,76.1 IC7.1 | IC9.1 38.23,32.89 38.76,32.89 40.18,31.47 43.56,31.47 44.81,32.72 44.81,34.14 v49.07,38.41 49.43,38.76 64.36,38.76 67.74,42.14 89.97,42.14 91.39,40.72 IC6.8 | IC8.1 38.76,62.23 42.14,58.85 46.05,58.85 49.78,55.12 49.78,52.27 v50.32,51.74